# Altium schematic sheet OSU_Robotics_Kids_LEDS.SchDoc
size A
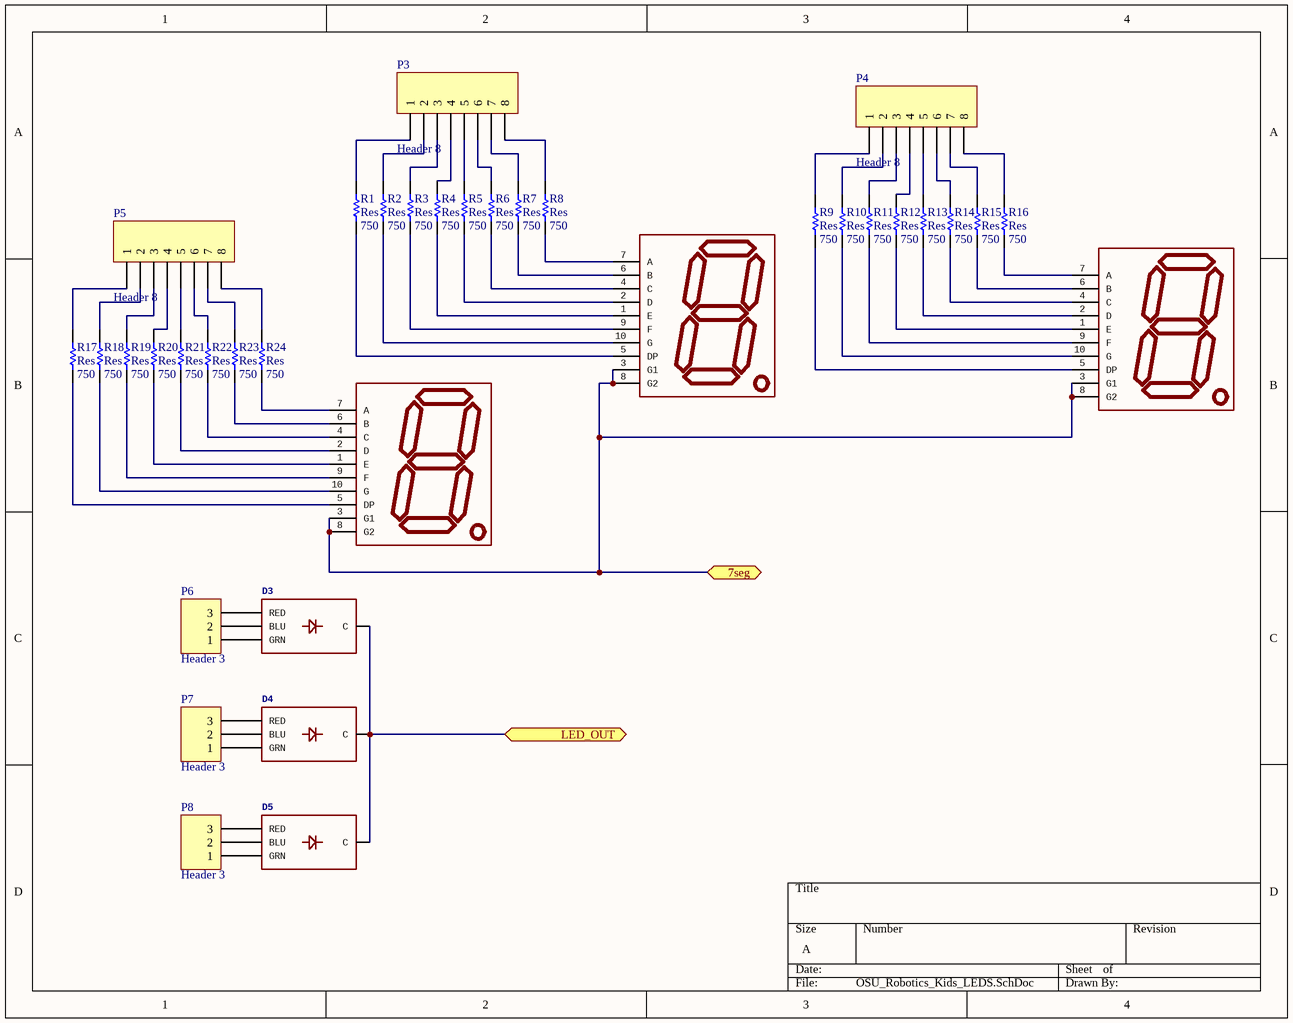
[diagram p0: OSU_Robotics_Kids_LEDS.SchDoc]

## Parts
1  7-Segment Display, single digit, 1"    EZ is for kits. Pads are only exposed on the bottom side to help prevent soldering in upside down.    Datasheet (Red) Datasheet (Blue) SparkFun Products  7-Segment Display - LED (Red) (COM-08546)  7-Segment Display - LED (Blue) (COM-09191)  [7-SEGMENT-1"PTH]  (value not drawn)
2  7-Segment Display, single digit, 1"    EZ is for kits. Pads are only exposed on the bottom side to help prevent soldering in upside down.    Datasheet (Red) Datasheet (Blue) SparkFun Products  7-Segment Display - LED (Red) (COM-08546)  7-Segment Display - LED (Blue) (COM-09191)  [7-SEGMENT-1"PTH]  (value not drawn)
3  7-Segment Display, single digit, 1"    EZ is for kits. Pads are only exposed on the bottom side to help prevent soldering in upside down.    Datasheet (Red) Datasheet (Blue) SparkFun Products  7-Segment Display - LED (Red) (COM-08546)  7-Segment Display - LED (Blue) (COM-09191)  [7-SEGMENT-1"PTH]  (value not drawn)
D3  (no value)  [LED-RGB-THRU]
D4  (no value)  [LED-RGB-THRU]
D5  (no value)  [LED-RGB-THRU]
P3  Header 8  [HDR1X8]
P4  Header 8  [HDR1X8]
P5  Header 8  [HDR1X8]
P6  Header 3  [HDR1X3]
P7  Header 3  [HDR1X3]
P8  Header 3  [HDR1X3]
R1  Res  value 750  [AXIAL-0.5]
R2  Res  value 750  [AXIAL-0.5]
R3  Res  value 750  [AXIAL-0.5]
R4  Res  value 750  [AXIAL-0.5]
R5  Res  value 750  [AXIAL-0.5]
R6  Res  value 750  [AXIAL-0.5]
R7  Res  value 750  [AXIAL-0.5]
R8  Res  value 750  [AXIAL-0.5]
R9  Res  value 750  [AXIAL-0.5]
R10  Res  value 750  [AXIAL-0.5]
R11  Res  value 750  [AXIAL-0.5]
R12  Res  value 750  [AXIAL-0.5]
R13  Res  value 750  [AXIAL-0.5]
R14  Res  value 750  [AXIAL-0.5]
R15  Res  value 750  [AXIAL-0.5]
R16  Res  value 750  [AXIAL-0.5]
R17  Res  value 750  [AXIAL-0.5]
R18  Res  value 750  [AXIAL-0.5]
R19  Res  value 750  [AXIAL-0.5]
R20  Res  value 750  [AXIAL-0.5]
R21  Res  value 750  [AXIAL-0.5]
R22  Res  value 750  [AXIAL-0.5]
R23  Res  value 750  [AXIAL-0.5]
R24  Res  value 750  [AXIAL-0.5]

## Ports
7seg, LED_OUT

## Nets
7seg: 1.3(G1) 1.8(G2) 2.3(G1) 2.8(G2) 3.3(G1) 3.8(G2) ; port 7seg
LED_OUT: D3.2(C) D4.2(C) D5.2(C) ; port LED_OUT
Net1_1: 1.1(E) R4.1
Net1_2: 1.2(D) R5.1
Net1_4: 1.4(C) R6.1
Net1_5: 1.5(DP) R1.1
Net1_6: 1.6(B) R7.1
Net1_7: 1.7(A) R8.1
Net1_9: 1.9(F) R3.1
Net1_10: 1.10(G) R2.1
Net2_1: 2.1(E) R12.1
Net2_2: 2.2(D) R13.1
Net2_4: 2.4(C) R14.1
Net2_5: 2.5(DP) R9.1
Net2_6: 2.6(B) R15.1
Net2_7: 2.7(A) R16.1
Net2_9: 2.9(F) R11.1
Net2_10: 2.10(G) R10.1
Net3_1: 3.1(E) R20.1
Net3_2: 3.2(D) R21.1
Net3_4: 3.4(C) R22.1
Net3_5: 3.5(DP) R17.1
Net3_6: 3.6(B) R23.1
Net3_7: 3.7(A) R24.1
Net3_9: 3.9(F) R19.1
Net3_10: 3.10(G) R18.1
NetD3_1: D3.1(RED) P6.3
NetD3_3: D3.3(GRN) P6.1
NetD3_4: D3.4(BLU) P6.2
NetD4_1: D4.1(RED) P7.3
NetD4_3: D4.3(GRN) P7.1
NetD4_4: D4.4(BLU) P7.2
NetD5_1: D5.1(RED) P8.3
NetD5_3: D5.3(GRN) P8.1
NetD5_4: D5.4(BLU) P8.2
NetP3_1: P3.1 R1.2
NetP3_2: P3.2 R2.2
NetP3_3: P3.3 R3.2
NetP3_4: P3.4 R4.2
NetP3_5: P3.5 R5.2
NetP3_6: P3.6 R6.2
NetP3_7: P3.7 R7.2
NetP3_8: P3.8 R8.2
NetP4_1: P4.1 R9.2
NetP4_2: P4.2 R10.2
NetP4_3: P4.3 R11.2
NetP4_4: P4.4 R12.2
NetP4_5: P4.5 R13.2
NetP4_6: P4.6 R14.2
NetP4_7: P4.7 R15.2
NetP4_8: P4.8 R16.2
NetP5_1: P5.1 R17.2
NetP5_2: P5.2 R18.2
NetP5_3: P5.3 R19.2
NetP5_4: P5.4 R20.2
NetP5_5: P5.5 R21.2
NetP5_6: P5.6 R22.2
NetP5_7: P5.7 R23.2
NetP5_8: P5.8 R24.2

## Library data of the parts
1-3 = 7-SEGMENT-1DIGIT-1INCH-BLUE: PROD_ID: COMP-09495
D3-D5 = LED-RGB-CCDIFFUSE: PROD_ID: DIO-09434
P3-P5 = Header 8: Header, 8-Pin; LatestRevisionDate: 17-Jul-2002; LatestRevisionNote: Re-released for DXP Platform.; Publisher: Altium Limited
P6-P8 = Header 3: Header, 3-Pin; LatestRevisionDate: 17-Jul-2002; LatestRevisionNote: Re-released for DXP Platform.; Publisher: Altium Limited
R1-R24 = Res Semi: Semiconductor Resistor; Published: 8-Jun-2000; LatestRevisionDate: 17-Jul-2002; LatestRevisionNote: Re-released for DXP Platform.; PackageReference: AXIAL-0.5; Publisher: Altium Limited; PackageDescription: Axial Device, Thru-Hole; 2 Leads; 0.5 in Pin Spacing